# Altium schematic sheet 04_ElectronicScales.SchDoc
size A4
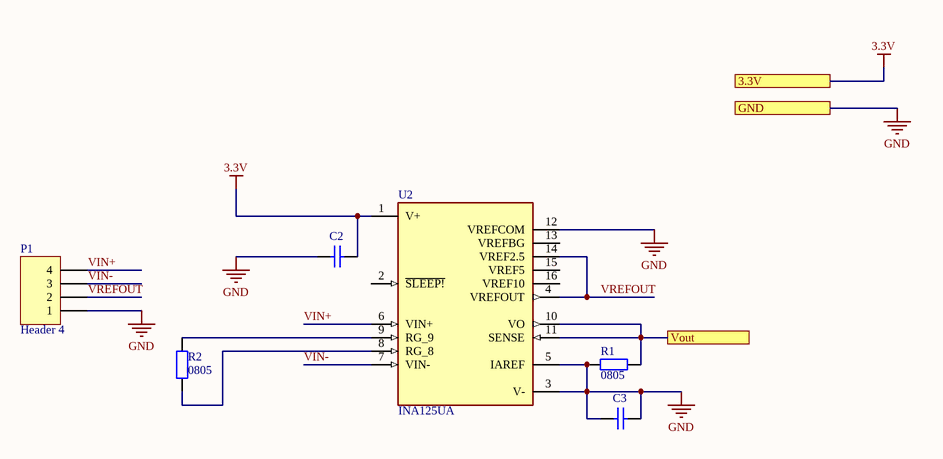
[diagram p0: 04_ElectronicScales.SchDoc]

## Parts
C2  Capacitor Ceramic  [C0805]  (value not drawn)
C3  Capacitor Ceramic  [C0805]  (value not drawn)
P1  Header 4  [HDR1X4]
R1  value 0805  [DIEN TRO 0805]  (hidden comment: R0805)
R2  value 0805  [DIEN TRO 0805]  (hidden comment: R0805)
U2  INA125UA  [SOIC127P600X175-16N]

## Ports
3.3V, GND, Vout

## Nets
3.3V: C2.2 U2.1(V+) ; port 3.3V
GND: C2.1 C3.1 C3.2 P1.1 R1.2 U2.3(V-) U2.5(IAREF) U2.12(VREFCOM) ; port GND
VIN+: P1.4 U2.6(VIN+)
VIN-: P1.3 U2.7(VIN-)
Vout: R1.1 U2.10(VO) U2.11(SENSE) ; port Vout
VREFOUT: P1.2 U2.4(VREFOUT) U2.14(VREF2.5)
NetR2_1: R2.1 U2.8(RG_8)
NetR2_2: R2.2 U2.9(RG_9)

Not connected (* = marked no-connect by the designer): U2 2(~{SLEEP!}) 13(VREFBG) 15(VREF5) 16(VREF10)

## Notes on the sheet
- Project:
- MANDevices
- Page Contents:
- Size:
- Date:
- A4
- Checked by:
- Time:
- Revision:
- Sheet
- of
- HaNoi University of
- Science and Technology
- File:

## Library data of the parts
C2 C3 = CapSMD: Capacitor; Value: 33p; Published: 8-Jun-2000; LatestRevisionDate: 17-Jul-2002; LatestRevisionNote: Re-released for DXP Platform.; PackageReference: RAD-0.3; Publisher: Altium Limited
P1 = Header 4: Header, 4-Pin; LatestRevisionDate: 17-Jul-2002; LatestRevisionNote: Re-released for DXP Platform.; Publisher: Altium Limited
R1 R2 = R0805: Resistor SMD 0805; Published: 8-Jun-2000; LatestRevisionDate: 17-Jul-2002; LatestRevisionNote: Re-released for DXP Platform.; PackageReference: AXIAL-0.4; Publisher: Altium Limited
U2 = INA125UA: Instrumentation Amplifier with Precision Voltage Reference 16-SOIC; Price: None; MP: INA125UA; Value: *; Availability: Unavailable; Package: None